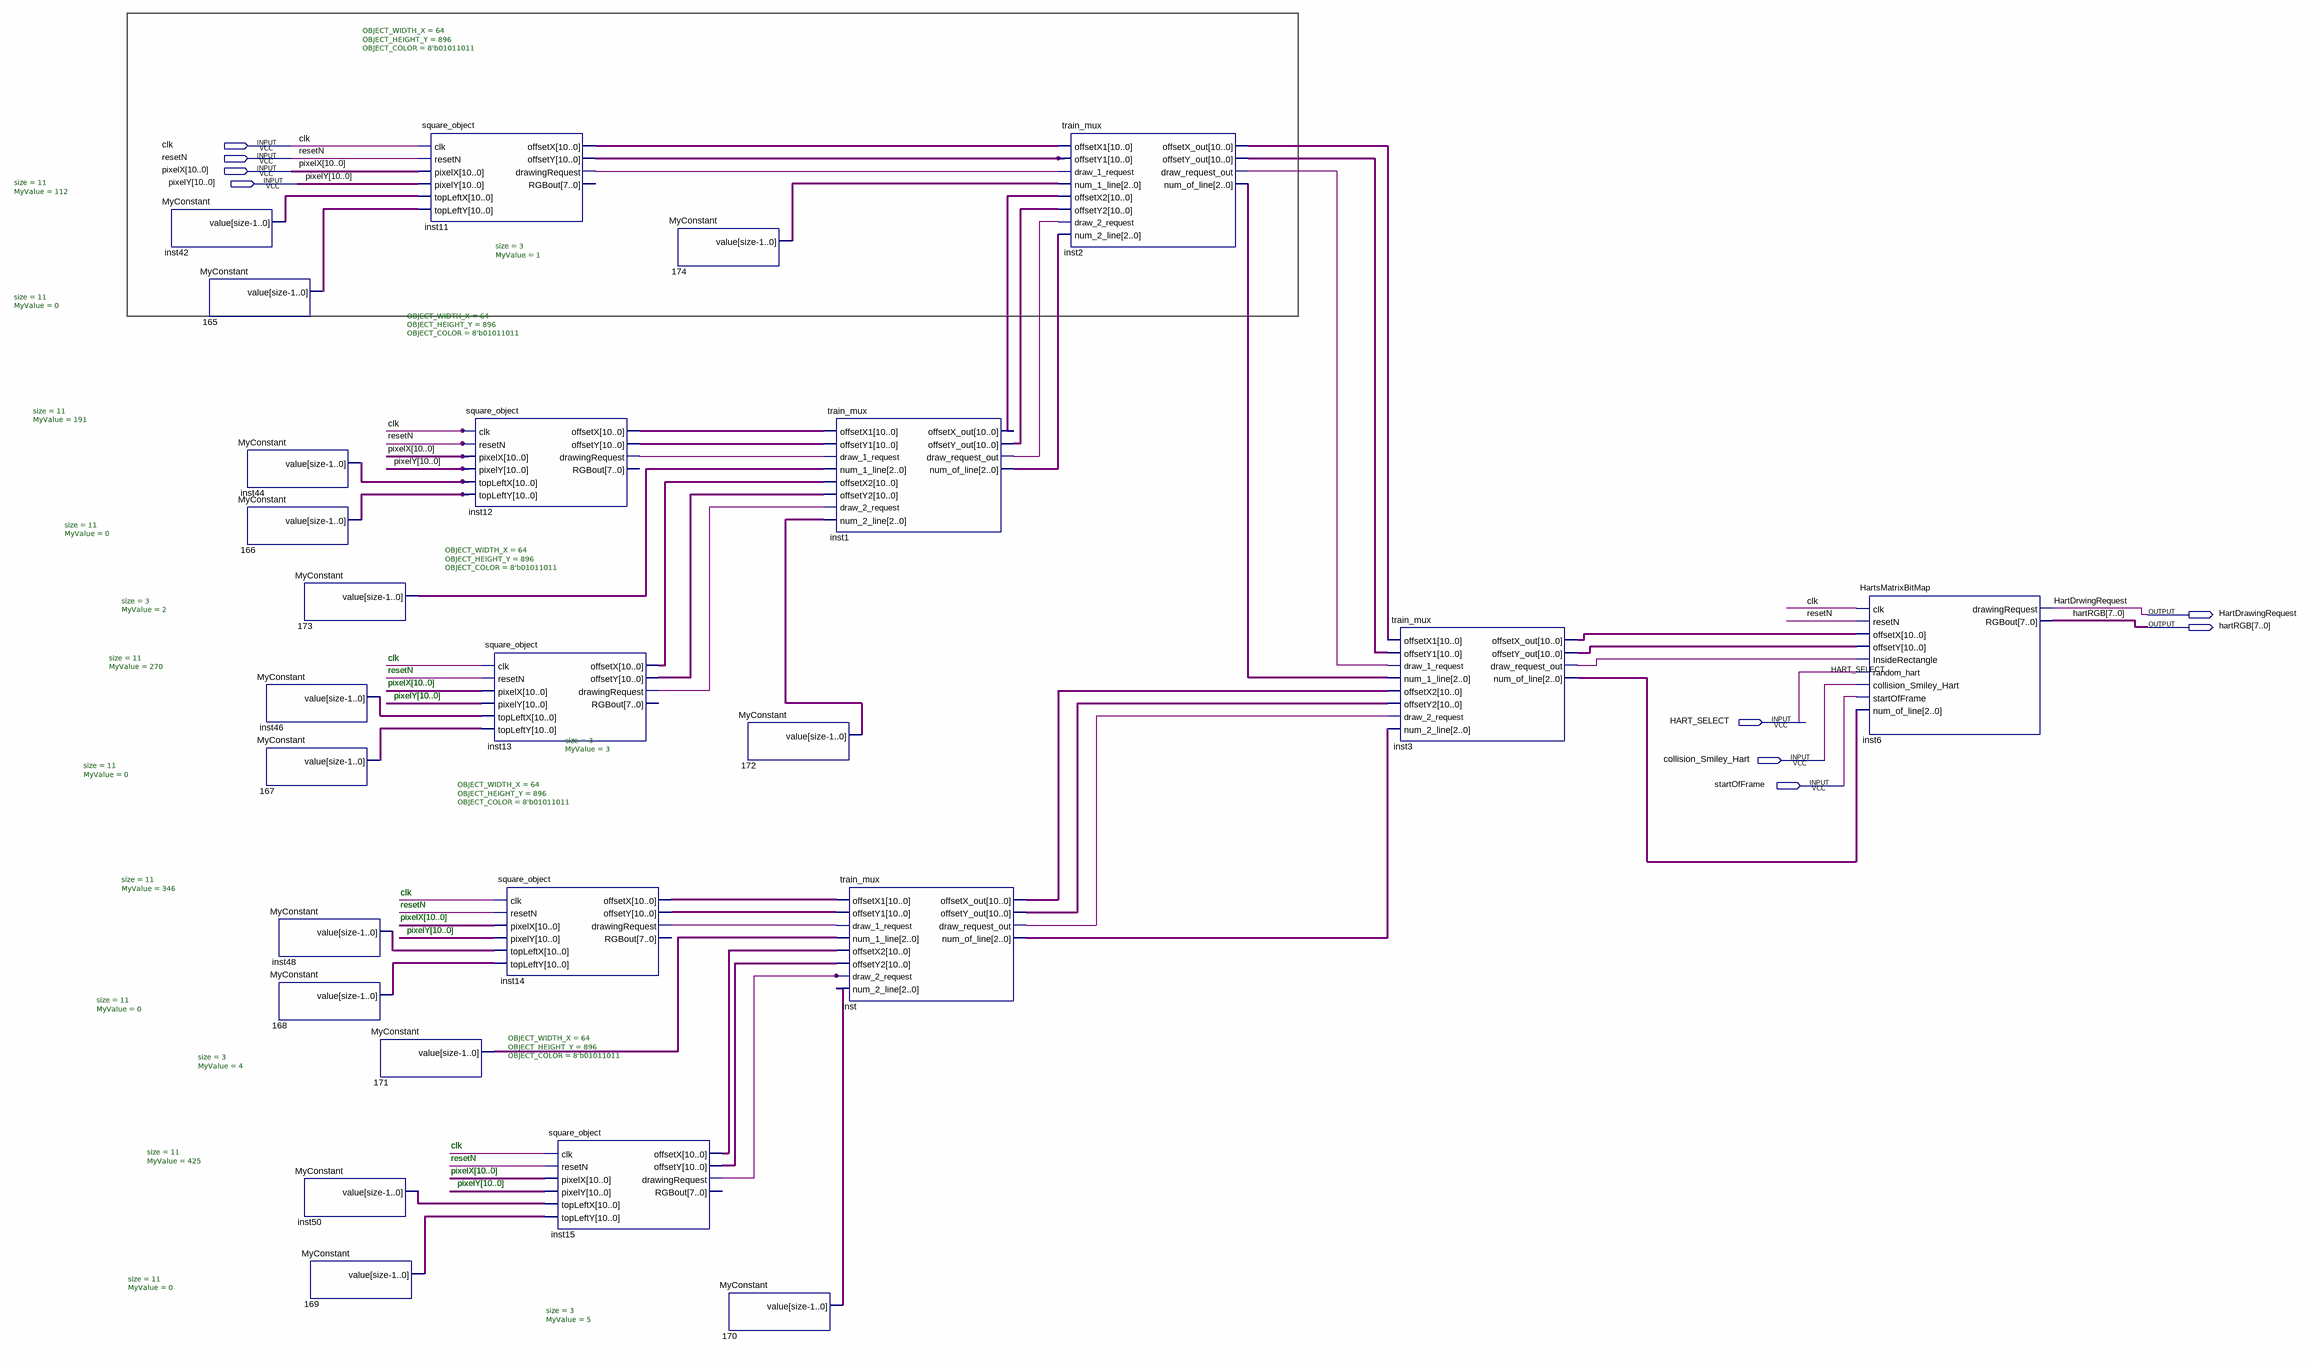
[diagram p0: schematic sheet]
// Quartus schematic HART_DISPLAY.bdf as structural Verilog: 25 symbols, 9 pins
module HART_DISPLAY (
  input  clk,
  input  resetN,
  input  [10:0] pixelX,
  input  [10:0] pixelY,
  input  HART_SELECT,
  input  collision_Smiley_Hart,
  input  startOfFrame,
  output HartDrawingRequest,
  output [7:0] hartRGB
);

  wire inst1_draw_request_out, inst2_draw_request_out, inst3_draw_request_out, inst11_drawingrequest,
       inst12_drawingrequest, inst13_drawingrequest, inst14_drawingrequest, inst15_drawingrequest,
       inst_draw_request_out;
  wire [2:0] inst1_num_of_line, inst2_num_of_line, inst3_num_of_line, inst_num_of_line, n170_value,
       n171_value, n172_value, n173_value, n174_value;
  wire [10:0] inst1_offsetx_out, inst1_offsety_out, inst2_offsetx_out, inst2_offsety_out, inst3_offsetx_out,
       inst3_offsety_out, inst11_offsetx, inst11_offsety, inst12_offsetx, inst12_offsety, inst13_offsetx,
       inst13_offsety, inst14_offsetx, inst14_offsety, inst15_offsetx, inst15_offsety, inst42_value,
       inst44_value, inst46_value, inst48_value, inst50_value, inst_offsetx_out, inst_offsety_out,
       n165_value, n166_value, n167_value, n168_value, n169_value;

  MyConstant #(.size(11), .MyValue(112)) inst42 (.value(inst42_value));
  MyConstant #(.size(11), .MyValue(0)) u_165 (.value(n165_value));
  MyConstant #(.size(11), .MyValue(191)) inst44 (.value(inst44_value));
  MyConstant #(.size(11), .MyValue(0)) u_166 (.value(n166_value));
  MyConstant #(.size(11), .MyValue(270)) inst46 (.value(inst46_value));
  MyConstant #(.size(11), .MyValue(0)) u_167 (.value(n167_value));
  MyConstant #(.size(3), .MyValue(2)) u_173 (.value(n173_value));
  MyConstant #(.size(11), .MyValue(346)) inst48 (.value(inst48_value));
  MyConstant #(.size(11), .MyValue(0)) u_168 (.value(n168_value));
  MyConstant #(.size(11), .MyValue(425)) inst50 (.value(inst50_value));
  MyConstant #(.size(11), .MyValue(0)) u_169 (.value(n169_value));
  MyConstant #(.size(3), .MyValue(4)) u_171 (.value(n171_value));
  square_object #(.OBJECT_WIDTH_X(64), .OBJECT_HEIGHT_Y(896), .OBJECT_COLOR(8'b01011011)) inst11 (
    .clk(clk), .resetN(resetN), .pixelX(pixelX), .pixelY(pixelY), .topLeftX(inst42_value),
    .topLeftY(n165_value), .offsetX(inst11_offsetx), .offsetY(inst11_offsety),
    .drawingRequest(inst11_drawingrequest));  // open: RGBout
  square_object #(.OBJECT_WIDTH_X(64), .OBJECT_HEIGHT_Y(896), .OBJECT_COLOR(8'b01011011)) inst12 (
    .clk(clk), .resetN(resetN), .pixelX(pixelX), .pixelY(pixelY), .topLeftX(inst44_value),
    .topLeftY(n166_value), .offsetX(inst12_offsetx), .offsetY(inst12_offsety),
    .drawingRequest(inst12_drawingrequest));  // open: RGBout
  square_object #(.OBJECT_WIDTH_X(64), .OBJECT_HEIGHT_Y(896), .OBJECT_COLOR(8'b01011011)) inst13 (
    .clk(clk), .resetN(resetN), .pixelX(pixelX), .pixelY(pixelY), .topLeftX(inst46_value),
    .topLeftY(n167_value), .offsetX(inst13_offsetx), .offsetY(inst13_offsety),
    .drawingRequest(inst13_drawingrequest));  // open: RGBout
  square_object #(.OBJECT_WIDTH_X(64), .OBJECT_HEIGHT_Y(896), .OBJECT_COLOR(8'b01011011)) inst14 (
    .clk(clk), .resetN(resetN), .pixelX(pixelX), .pixelY(pixelY), .topLeftX(inst48_value),
    .topLeftY(n168_value), .offsetX(inst14_offsetx), .offsetY(inst14_offsety),
    .drawingRequest(inst14_drawingrequest));  // open: RGBout
  square_object #(.OBJECT_WIDTH_X(64), .OBJECT_HEIGHT_Y(896), .OBJECT_COLOR(8'b01011011)) inst15 (
    .clk(clk), .resetN(resetN), .pixelX(pixelX), .pixelY(pixelY), .topLeftX(inst50_value),
    .topLeftY(n169_value), .offsetX(inst15_offsetx), .offsetY(inst15_offsety),
    .drawingRequest(inst15_drawingrequest));  // open: RGBout
  MyConstant #(.size(3), .MyValue(1)) u_174 (.value(n174_value));
  MyConstant #(.size(3), .MyValue(3)) u_172 (.value(n172_value));
  MyConstant #(.size(3), .MyValue(5)) u_170 (.value(n170_value));
  train_mux inst1 (
    .offsetX1(inst12_offsetx), .offsetY1(inst12_offsety), .draw_1_request(inst12_drawingrequest),
    .num_1_line(n173_value), .offsetX2(inst13_offsetx), .offsetY2(inst13_offsety),
    .draw_2_request(inst13_drawingrequest), .num_2_line(n172_value), .offsetX_out(inst1_offsetx_out),
    .offsetY_out(inst1_offsety_out), .draw_request_out(inst1_draw_request_out),
    .num_of_line(inst1_num_of_line));
  train_mux inst (
    .offsetX1(inst14_offsetx), .offsetY1(inst14_offsety), .draw_1_request(inst14_drawingrequest),
    .num_1_line(n171_value), .offsetX2(inst15_offsetx), .offsetY2(inst15_offsety),
    .draw_2_request(inst15_drawingrequest), .num_2_line(n170_value), .offsetX_out(inst_offsetx_out),
    .offsetY_out(inst_offsety_out), .draw_request_out(inst_draw_request_out), .num_of_line(inst_num_of_line));
  train_mux inst2 (
    .offsetX1(inst11_offsetx), .offsetY1(inst11_offsety), .draw_1_request(inst11_drawingrequest),
    .num_1_line(n174_value), .offsetX2(inst1_offsetx_out), .offsetY2(inst1_offsety_out),
    .draw_2_request(inst1_draw_request_out), .num_2_line(inst1_num_of_line), .offsetX_out(inst2_offsetx_out),
    .offsetY_out(inst2_offsety_out), .draw_request_out(inst2_draw_request_out),
    .num_of_line(inst2_num_of_line));
  train_mux inst3 (
    .offsetX1(inst2_offsetx_out), .offsetY1(inst2_offsety_out), .draw_1_request(inst2_draw_request_out),
    .num_1_line(inst2_num_of_line), .offsetX2(inst_offsetx_out), .offsetY2(inst_offsety_out),
    .draw_2_request(inst_draw_request_out), .num_2_line(inst_num_of_line), .offsetX_out(inst3_offsetx_out),
    .offsetY_out(inst3_offsety_out), .draw_request_out(inst3_draw_request_out),
    .num_of_line(inst3_num_of_line));
  HartsMatrixBitMap inst6 (
    .clk(clk), .resetN(resetN), .offsetX(inst3_offsetx_out), .offsetY(inst3_offsety_out),
    .InsideRectangle(inst3_draw_request_out), .random_hart(HART_SELECT),
    .collision_Smiley_Hart(collision_Smiley_Hart), .startOfFrame(startOfFrame),
    .num_of_line(inst3_num_of_line), .drawingRequest(HartDrawingRequest), .RGBout(hartRGB));

  // Other names for the same wires on the sheet: HartDrwingRequest = HartDrawingRequest

  // Notes on the sheet:
  //   clk
  //   resetN
  //   pixelX[10..0]
  //   pixelY[10..0]
  //   clk
  //   resetN
  //   pixelX[10..0]
  //   pixelY[10..0]
  //   clk
  //   resetN
  //   pixelX[10..0]
  //   pixelY[10..0]
endmodule
